# EAGLE design i2c erm1602+encoder (EAGLE 6.4)
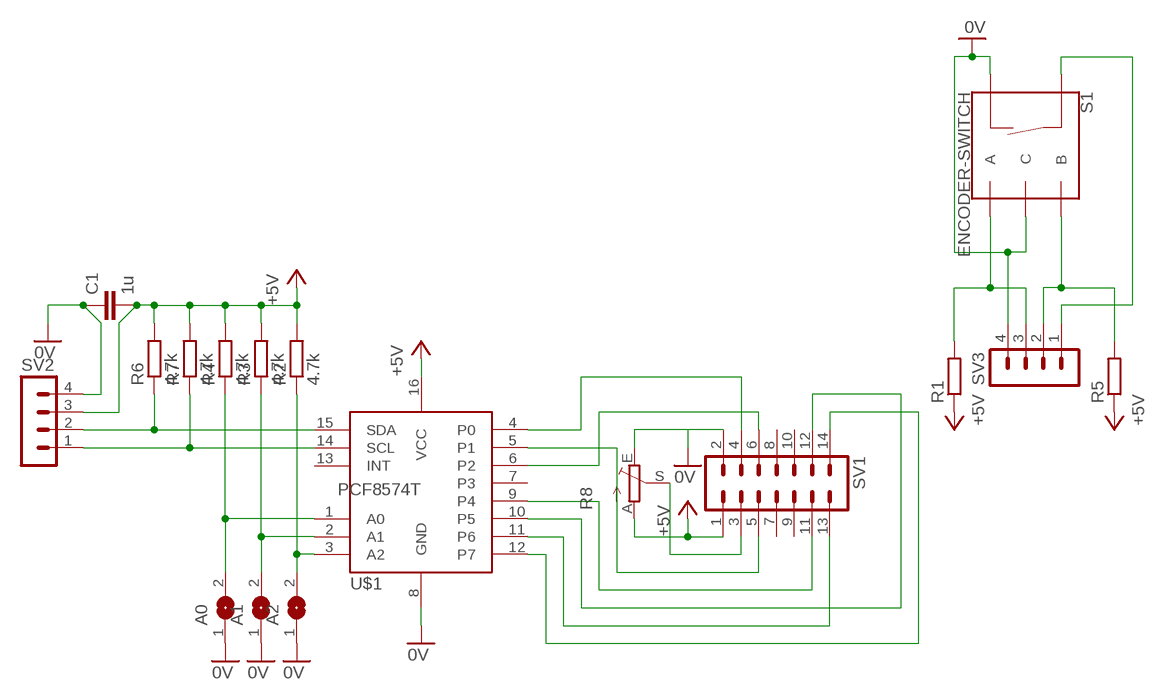
[diagram p0: schematic, sheet 1]

## Parts
A0  SJ  [SJ]
A1  SJ  [SJ]
A2  SJ  [SJ]
C1  1u  C-EUC1206K  [C1206K]
R1  R-EU_0204/5  [0204/5]
R2  4.7k  R-EU_0204/5  [0204/5]
R3  4.7k  R-EU_0204/5  [0204/5]
R4  4.7k  R-EU_0204/5  [0204/5]
R5  R-EU_0204/5  [0204/5]
R6  4.7k  R-EU_0204/5  [0204/5]
R7  4.7k  R-EU_0204/5  [0204/5]
R8  TRIM_EU-B25P  [B25P]
S1  ENCODER-SWITCH  [ROTARY_ENC_PLAIN]
SV1  MA07-2  [MA07-2]
SV2  MA04-1  [MA04-1]
SV3  MA04-1  [MA04-1]
U$1  PCF8574T  [SOT162]

## Nets
0V: A0.1 A1.1 A2.1 C1.1 R8.E S1.C S1.SW- SV1.2 SV2.4 SV3.4 U$1.8(GND)
+5V: C1.2 R1.1 R2.2 R3.2 R4.2 R5.1 R6.2 R7.2 R8.A SV1.1 SV2.3 U$1.16(VCC)
N$1: A0.2 R4.1 U$1.1(A0)
N$2: A1.2 R3.1 U$1.2(A1)
N$3: A2.2 R2.1 U$1.3(A2)
N$4: SV1.4 U$1.4(P0)
N$5: R6.1 SV2.2 U$1.15(SDA)
N$6: R7.1 SV2.1 U$1.14(SCL)
N$7: SV1.5 U$1.5(P1)
N$8: SV1.14 U$1.12(P7)
N$9: SV1.13 U$1.11(P6)
N$10: SV1.12 U$1.10(P5)
N$11: SV1.11 U$1.9(P4)
N$12: SV1.6 U$1.6(P2)
N$13: R1.2 S1.A SV3.3
N$14: R8.S SV1.3
N$15: R5.2 S1.B SV3.2
N$17: S1.SW+ SV3.1
Unconnected: SV1.7 SV1.8 SV1.9 SV1.10 U$1.7(P3) U$1.13(INT)

## Library data of the parts
A0 A1 A2 = jumper:SJ: SMD solder JUMPER
C1 = rcl:C-EU: CAPACITOR, European symbol
R1-R7 = rcl:R-EU_: RESISTOR, European symbol
R8 = pot:TRIM_EU-: POTENTIOMETER
S1 = SparkFun-Switches:ENCODER-SWITCH: Rotary Encoder w/ Select Switch Encoders rotate similarly to potentiometers, but they’re different from potentiometers in that an encoder has full rotation without limits. They output gray code so that you can tell how much and in which direction the encoder has been turned. This encoder includes a push-down select switch built into the shaft. SparkFun Products Rotary Encoder <https://www.sparkfun.com/products/9117> (COM-09117); SF_SKU: COM-09117
SV1 = con-lstb:MA07-2: PIN HEADER; OC_FARNELL: unknown; OC_NEWARK: unknown
SV2 SV3 = con-lstb:MA04-1: PIN HEADER; OC_FARNELL: unknown; OC_NEWARK: unknown
U$1 = DANTE:PCF8574T: PCF8574; PCF8574A Remote 8-bit I/O expander for I2C-bus with interrupt

## Board
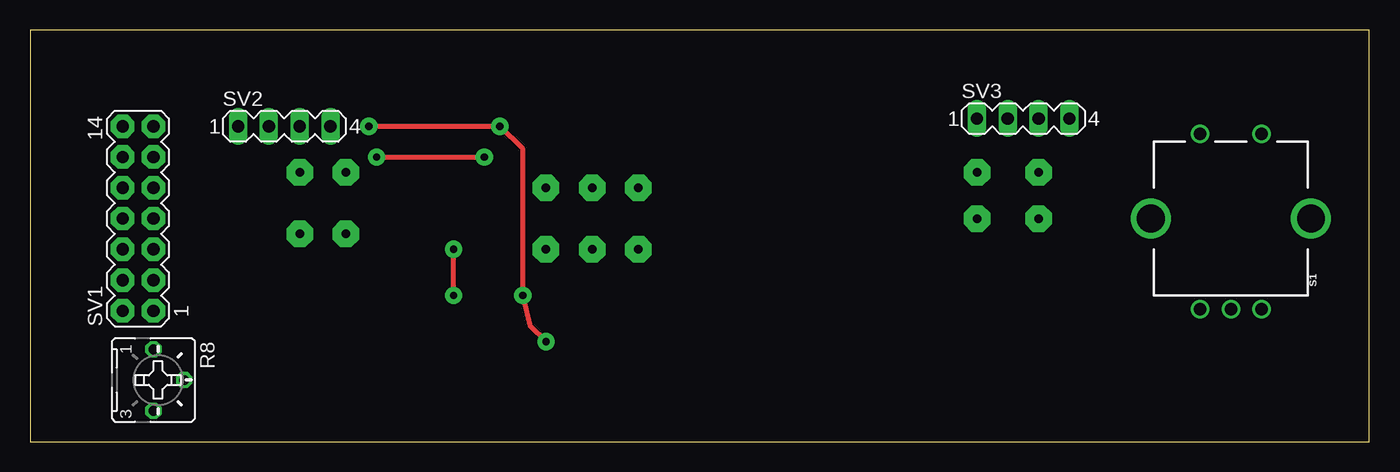
[diagram p1: board, top side]
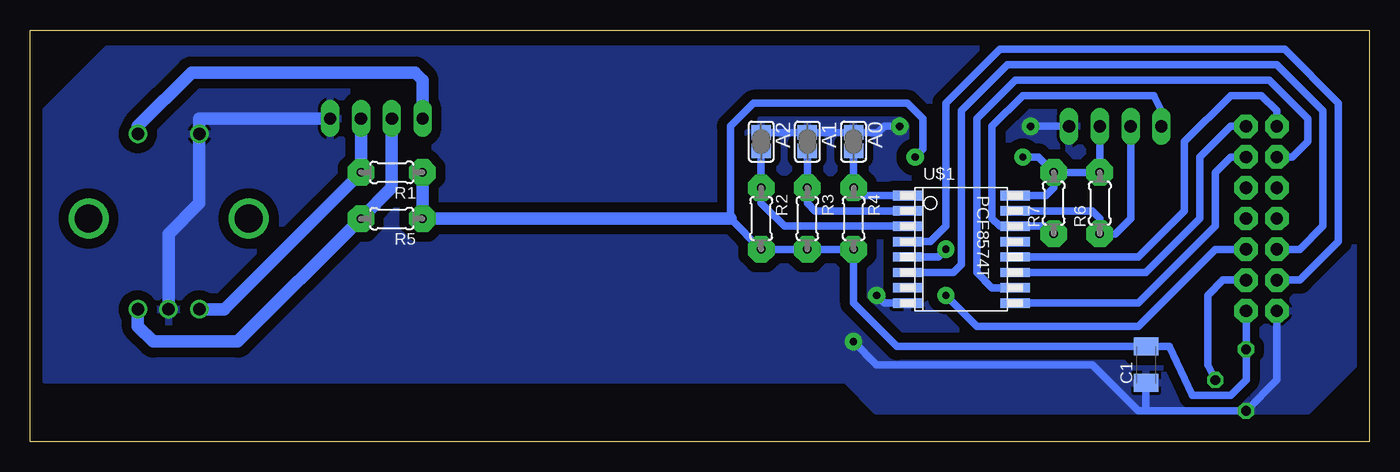
[diagram p2: board, bottom side, seen from below]

Size 110.47 x 33.96 mm. Coordinates in mm from the lower left corner, seen from the top.
Outline: 0,0 110.47,0 110.47,33.96 0,33.96 0,0
Copper layers (1*16): Top 0.035mm / dielectric 1.5mm / Bottom 0.035mm
Design rules "default": minimum track width 10mil, minimum drill 24mil, track to track 8mil, track to pad 8mil, pad to pad 8mil, via to via 8mil, smd to smd 8mil, copper to edge 40mil, drill to drill 8mil, minimum pad ring 10mil, minimum via ring 8mil, stop-mask expansion 4mil, vias tented up to drill 0mil, thermal gap 10mil

### Footprints (pad centres in the part's own frame; a part is rotated, then mirrored left to right if it is on the bottom)
SJ = smd 1.168 x 1.6: 1 -0.762,0; 2 0.762,0
C1206K = smd 1.5 x 2: 1 -1.5,0; 2 1.5,0
0204/5 = drill 0.7 pad 2.184 octagon: 1 -2.54,0; 2 2.54,0
B25P = drill 0.813 octagon: A -2.54,0; E 2.54,0; S 0,2.54
ROTARY_ENC_PLAIN = drill 1.016: A 7.493,-2.54; B 7.493,2.54; C 7.493,0; SW+ -6.985,2.54; SW- -6.985,-2.54 | drill 2.286: P$3 0,6.604; P$4 0,-6.604
MA07-2 = drill 1.016 pad 1.93 octagon: 1 -7.62,-1.27; 2 -7.62,1.27; 3 -5.08,-1.27; 4 -5.08,1.27; 5 -2.54,-1.27; 6 -2.54,1.27; 7 0,-1.27; 8 0,1.27; 9 2.54,-1.27; 10 2.54,1.27; 11 5.08,-1.27; 12 5.08,1.27; 13 7.62,-1.27; 14 7.62,1.27
MA04-1 = drill 1.016 long: 1 -3.81,0; 2 -1.27,0; 3 1.27,0; 4 3.81,0
SOT162 = smd 2.413 x 0.813: 1 -4.445,4.445; 8 -4.445,-4.445; 9 4.445,-4.445; 16 4.445,4.445 | smd 2.413 x 0.762: 2 -4.445,3.175; 3 -4.445,1.905; 4 -4.445,0.635; 5 -4.445,-0.635; 6 -4.445,-1.905; 7 -4.445,-3.175; 10 4.445,-3.175; 11 4.445,-1.905; 12 4.445,-0.635; 13 4.445,0.635; 14 4.445,1.905; 15 4.445,3.175

### Placement (x,y rotation side)
A0  42.55,24.77 270 bottom
A1  46.35,24.77 270 bottom
A2  50.16,24.77 270 bottom
C1  18.41,6.35 90 bottom
R1  80.64,22.23 180 bottom
R2  50.16,18.41 270 bottom
R3  46.35,18.41 270 bottom
R4  42.55,18.41 270 bottom
R5  80.64,18.41 180 bottom
R6  22.23,19.68 90 bottom
R7  26.04,19.68 90 bottom
R8  10.16,5.08 270 top
S1  99.06,18.41 270 top
SV1  8.89,18.41 90 top
SV2  20.95,26.04 0 top
SV3  81.92,26.67 0 top
U$1  33.66,15.88 0 bottom

### Tracks (layer width: path | path; a pad name or v marks a point on that pad's centre or on a via)
0V  (via drill 0.6 pad 1.42)
  Top 0.406: v27.94,26.04 v38.73,26.04 40.64,24.13 v40.64,12.06 41.27,9.53 v42.55,8.26
  Bottom 0.61: SV1.2 7.62,5.08 R8.E 18.41,2.54 | A2.1 A1.1 A0.1 40.51,25.53 40.01,26.04 v38.73,26.04 | SV2.4 v27.94,26.04 | U$1.8 40.01,11.43 v40.64,12.06 | 18.41,2.54 19.05,2.54 22.86,6.35 40.64,6.35 v42.55,8.26 | C1.1 18.41,2.54
  Bottom 1.016: SV3.4 96.52,26.67 S1.SW- 96.52,19.68 99.06,17.14 S1.C
  pour Bottom (isolate 0.813): 1.91,32.38 104.14,32.38 109.86,26.67 109.86,5.71 109.22,5.08 43.18,5.08 40.64,2.54 5.08,2.54 1.27,6.35 1.27,31.75
+5V  (via drill 0.6 pad 1.42)
  Top 0.406: v28.57,23.5 v37.47,23.5
  Bottom 0.61: SV1.1 R8.A 10.16,5.08 11.43,3.81 14.61,3.81 16.51,7.85 C1.2 38.97,7.85 42.55,11.43 R4.2 R3.2 R2.2 52.7,18.41 52.7,26.04 50.8,27.94 38.1,27.94 36.83,26.67 36.83,24.13 v37.47,23.5 | U$1.16 26.67,20.32 26.04,20.95 R7.2 | R7.2 R6.2 SV2.3 | v28.57,23.5 27.3,23.5 R7.2
  Bottom 1.016: R1.1 R5.1 52.7,18.41
N$1
  Bottom 0.61: U$1.1 41.91,20.32 R4.1 A0.2
N$2
  Bottom 0.61: U$1.2 45.72,19.05 46.35,19.68 R3.1 A1.2
N$3
  Bottom 0.61: U$1.3 48.26,17.78 50.16,19.68 R2.1 A2.2
N$4
  Bottom 0.61: SV1.4 5.71,13.34 2.54,16.51 2.54,27.94 6.99,32.38 30.48,32.38 34.92,27.94 34.92,17.78 36.2,16.51 U$1.4
N$5
  Bottom 0.61: U$1.15 22.86,19.05 22.23,18.41 R6.1 20.95,17.14 19.68,18.41 SV2.2
N$6
  Bottom 0.61: R7.1 26.67,17.78 U$1.14 30.48,17.78 31.11,18.41 31.11,26.04 28.57,28.57 17.78,28.57 17.14,27.3 SV2.1
N$7  (via drill 0.6 pad 1.42)
  Top 0.406: v34.92,12.06 v34.92,15.88
  Bottom 0.61: SV1.5 12.7,15.88 19.05,9.53 32.38,9.53 v34.92,12.06 | v34.92,15.88 35.56,15.24 U$1.5
N$8
  Bottom 0.61: U$1.12 19.05,15.24 15.24,19.05 15.24,24.77 11.43,28.57 8.89,28.57 7.62,27.3 SV1.14
N$9
  Bottom 0.61: U$1.11 18.41,13.97 13.97,18.41 13.97,23.5 11.43,26.04 SV1.13
N$10
  Bottom 0.61: SV1.12 6.35,23.5 5.08,24.77 5.08,26.67 8.26,29.84 29.21,29.84 32.38,26.67 32.38,13.97 31.11,12.7 U$1.10
N$11
  Bottom 0.61: U$1.9 19.05,11.43 12.7,17.78 12.7,22.23 11.43,23.5 SV1.11
N$12
  Bottom 0.61: SV1.6 5.71,15.88 3.81,17.78 3.81,27.3 7.62,31.11 29.84,31.11 33.66,27.3 33.66,14.61 34.29,13.97 U$1.6
N$13
  Bottom 1.016: SV3.3 R1.2 94.49,10.92 S1.A
N$14
  Bottom 0.61: R8.S 13.34,6.35 13.34,12.06 12.06,13.34 SV1.3
N$15
  Bottom 1.016: SV3.2 80.64,20.95 R5.2 93.34,8.26 100.33,8.26 101.6,9.53 S1.B
N$17
  Bottom 1.016: SV3.1 78.11,29.84 78.74,30.48 97.16,30.48 101.6,26.04 S1.SW+